# EAGLE design ai_levelshifter_MOSFET (EAGLE 7.1.0)
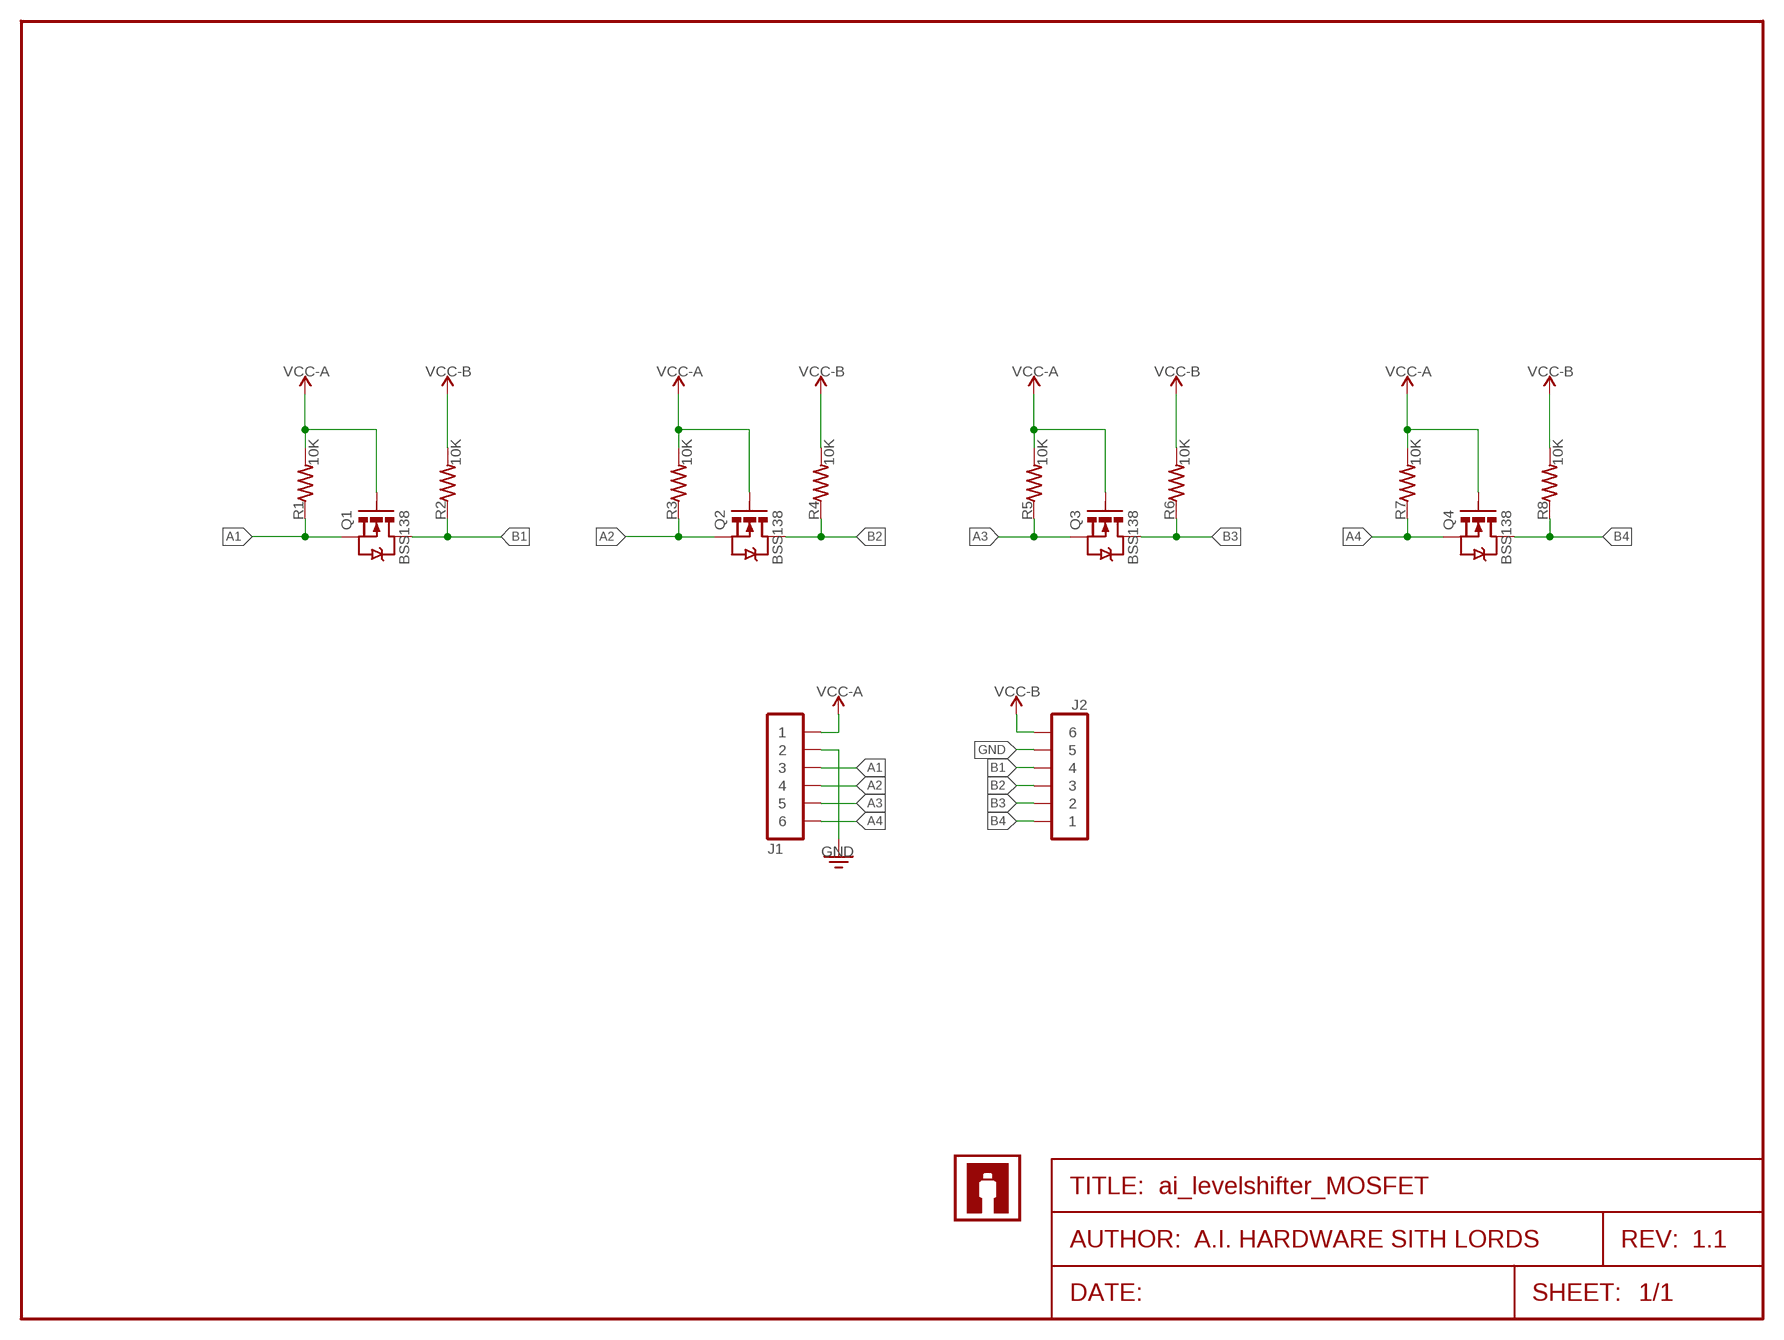
[diagram p0: schematic, sheet 1]
FRAME1 (FRAME-LETTER): AUTHOR: A.I. HARDWARE SITH LORDS; REV: 1.1

## Parts
J1  1X06  [1X06]
J2  1X06NOFIRST  [1X06-NOFIRST]
Q1  BSS138  FET-NMOS-BSS138  [SOT-23]
Q2  BSS138  FET-NMOS-BSS138  [SOT-23]
Q3  BSS138  FET-NMOS-BSS138  [SOT-23]
Q4  BSS138  FET-NMOS-BSS138  [SOT-23]
R1  10K  RES0603  [RES-0603]
R2  10K  RES0603  [RES-0603]
R3  10K  RES0603  [RES-0603]
R4  10K  RES0603  [RES-0603]
R5  10K  RES0603  [RES-0603]
R6  10K  RES0603  [RES-0603]
R7  10K  RES0603  [RES-0603]
R8  10K  RES0603  [RES-0603]
U$1  AI-LOGOXS  [AI-LOGO-XS]

## Nets
A1: J1.3 Q1.2(S) R1.1
A2: J1.4 Q2.2(S) R3.1
A3: J1.5 Q3.2(S) R5.1
A4: J1.6 Q4.2(S) R7.1
B1: J2.4 Q1.3(D) R2.1
B2: J2.3 Q2.3(D) R4.1
B3: J2.2 Q3.3(D) R6.1
B4: J2.1 Q4.3(D) R8.1
GND: J1.2 J2.5
VCC-A: J1.1 Q1.1(G) Q2.1(G) Q3.1(G) Q4.1(G) R1.2 R3.2 R5.2 R7.2
VCC-B: J2.6 R2.2 R4.2 R6.2 R8.2

## Library data of the parts
J1 J2 = Ai_Connectors:1X06
Q1-Q4 = Ai_DiscreteSemis:FET-NMOS
R1-R8 = Ai_Passives:RES: Part # blah Digikey
U$1 = Ai_Miscellany:AI-LOGO

## Net classes
0 default: width 0.254 mm, clearance 0.152 mm

## Board
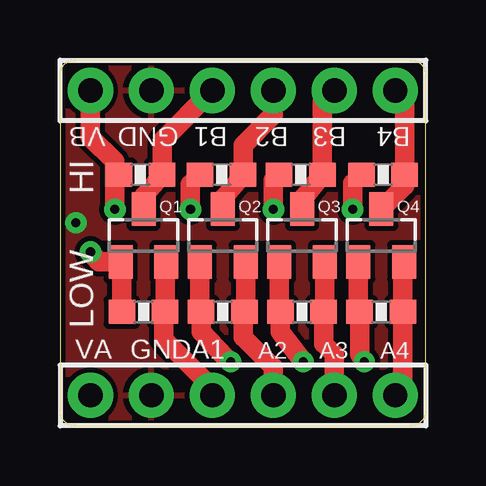
[diagram p1: board, top side]
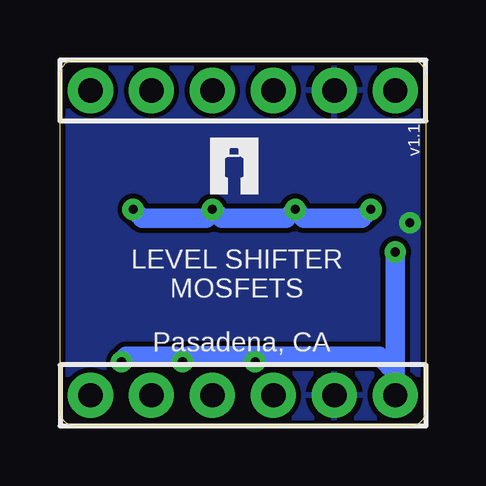
[diagram p2: board, bottom side, seen from below]

Size 15.24 x 15.24 mm. Coordinates in mm from the lower left corner, seen from the top.
Outline: 15.24,0.64 15.24,14.61 arc90 14.61,15.24 0.64,15.24 arc90 0,14.61 0,0.64 arc90 0.64,0 14.61,0 arc90 15.24,0.64
Copper layers (1*16): Top 0.035mm / dielectric 1.5mm / Bottom 0.035mm
Design rules "ai_2layer": minimum track width 7mil, minimum drill 15mil, track to track 8mil, track to pad 8mil, pad to pad 8mil, via to via 8mil, smd to smd 8mil, copper to edge 8mil, drill to drill 8mil, minimum pad ring 12mil, minimum via ring 10mil, stop-mask expansion 4mil, vias tented up to drill 20mil, thermal gap 10mil

### Footprints (pad centres in the part's own frame; a part is rotated, then mirrored left to right if it is on the bottom)
1X06 = drill 1.016 pad 1.88: 1 -6.35,0; 2 -3.81,0; 3 -1.27,0; 4 1.27,0; 5 3.81,0; 6 6.35,0
1X06-NOFIRST = drill 1.016 pad 1.88: 1 -6.35,0; 2 -3.81,0; 3 -1.27,0; 4 1.27,0; 5 3.81,0; 6 6.35,0
SOT-23 = smd 1 x 1.4: 1 -0.95,-1.1; 2 0.95,-1.1; 3 0,1.1
RES-0603 = smd 1.1 x 1: 1 -0.9,0; 2 0.9,0

### Placement (x,y rotation side)
J1  7.62,1.27 0 top
J2  7.62,13.97 180 top
Q1  3.48,7.92 0 top
Q2  6.78,7.92 0 top
Q3  10.08,7.92 0 top
Q4  13.39,7.92 0 top
R1  3.48,4.75 180 top
R2  3.35,10.46 180 top
R3  6.78,4.75 180 top
R4  6.73,10.46 180 top
R5  10.08,4.75 180 top
R6  10.03,10.46 180 top
R7  13.39,4.75 180 top
R8  13.46,10.46 180 top
U$1  8.97,9.65 0 bottom

### Tracks (layer width: path | path; a pad name or v marks a point on that pad's centre or on a via)
A1
  Top 0.813: Q1.2 4.38,6.14 R1.1 4.32,4.69 4.32,3.61 6.35,1.57 J1.3
A2
  Top 0.813: Q2.2 7.73,4.8 R3.1 7.64,4.71 7.64,3.68 8.89,2.44 J1.4
A3
  Top 0.813: Q3.2 11.03,4.8 R5.1 10.98,3.42 11.43,2.97 J1.5
A4
  Top 0.813: Q4.2 14.29,6.14 R7.1 14.29,1.59 J1.6
B1
  Top 0.813: Q1.3 3.48,9.56 R2.1 4.25,11.87 J2.4
B2
  Top 0.813: Q2.3 6.81,9.49 R4.1 7.63,11.7 8.89,12.95 J2.3
B3
  Top 0.813: Q3.3 10.03,9.36 R6.1 10.93,13.47 J2.2
B4
  Top 0.813: J2.1 14.36,13.58 R8.1 14.36,10 Q4.3
GND  (via drill 0.38)
  other vias: 0.66,8.46
  pour Bottom: 0,0 15.24,0 15.24,15.24 0,15.24
  pour Top: 0,0 0,15.24 15.24,15.24 15.24,0
VCC-A  (via drill 0.38)
  Top 0.813: Q2.1 5.83,4.8 R3.2 5.88,3.92 6.88,2.85 v7.11,2.67 | Q3.1 9.13,4.8 R5.2 9.18,3.92 v10.13,2.67 | Q4.1 12.44,4.8 R7.2 12.49,2.98 v12.68,2.67 | 2.53,4.8 R1.2 2.58,6.78 Q1.1 1.62,6.83 v1.27,7.24
  Bottom 0.813: v12.68,2.67 12.47,2.9 10.44,2.9 v10.13,2.67 9.88,2.92 6.91,2.92 | 6.81,2.92 6.91,2.92 | J1.1 1.27,2.49 | 1.27,2.49 v1.27,7.24 | v7.11,2.67 6.88,2.9 | 6.88,2.9 1.93,2.9 1.52,2.49 1.27,2.49 | 6.88,2.9 6.91,2.92
VCC-B  (via drill 0.38)
  Top 0.813: R2.2 2.29,10.3 | 2.29,10.3 v2.29,9.02 | R4.2 5.44,10.07 v5.44,9.02 | R8.2 12.19,10.1 v12.19,9.02 | J2.6 1.27,12.03 2.29,11.01 2.29,10.3 | R6.2 8.89,10.22 v8.89,9.02
  Bottom 0.813: v2.29,9.02 2.67,8.64 5.08,8.64 v5.44,9.02 5.82,8.64 8.51,8.64 v8.89,9.02 9.14,8.64 11.81,8.64 v12.19,9.02

### Text on the board
tPlace: VB | GND | B1 | B2 | B3 | B4 | HI | LOW | VA | GND | A1 | A2 | A3 | A4
bPlace: v1.1 | LEVEL SHIFTER / MOSFETS | Pasadena, CA